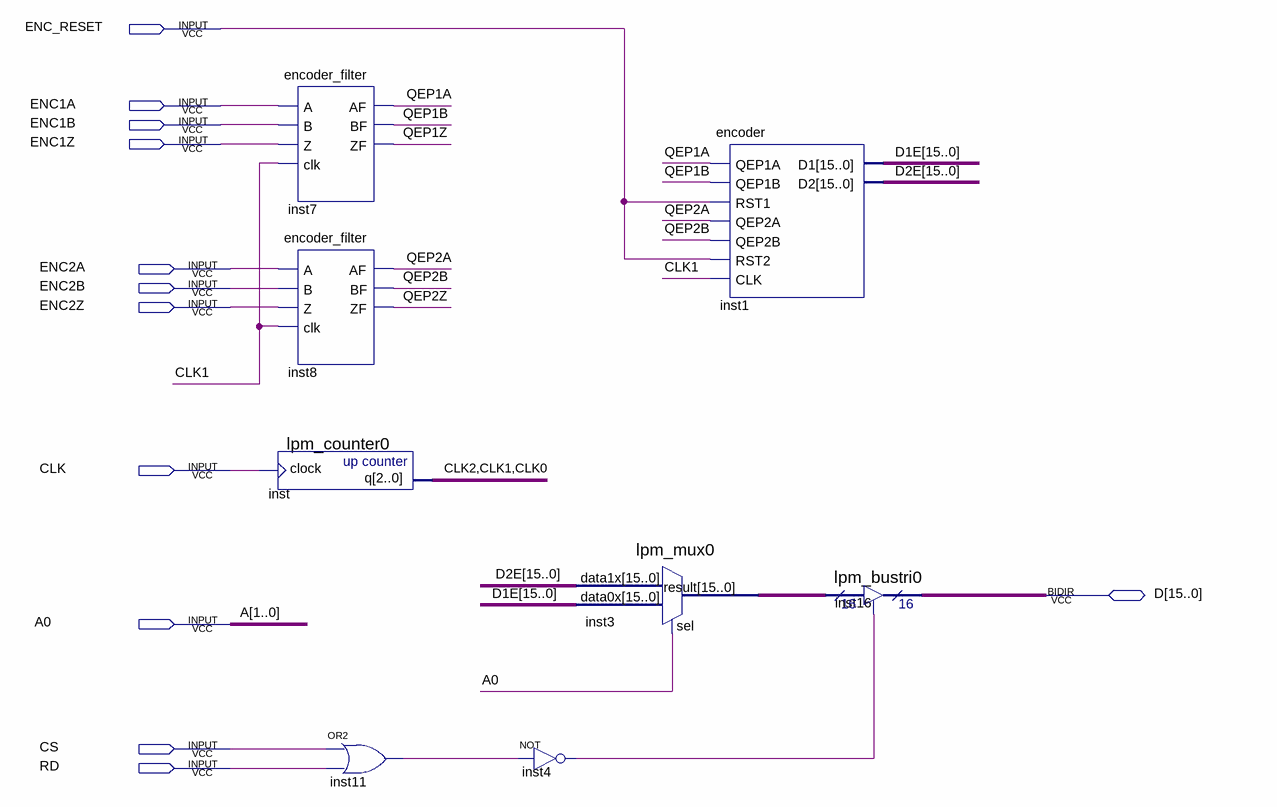
[diagram p0: schematic sheet]
// Quartus schematic enc_module.bdf as structural Verilog: 8 symbols, 12 pins
module enc_module (
  input  ENC_RESET,
  input  ENC1A,
  input  ENC1B,
  input  ENC1Z,
  input  ENC2A,
  input  ENC2B,
  input  ENC2Z,
  input  CLK,
  input  A0,
  input  CS,
  input  RD,
  inout  [15:0] D
);

  wire CLK0, CLK1, CLK2, inst4_out, inst11_out, QEP1A, QEP1B, QEP1Z, QEP2A, QEP2B, QEP2Z;
  wire [15:0] D1E, D2E, inst3_result;

  encoder_filter inst7 (.A(ENC1A), .B(ENC1B), .Z(ENC1Z), .clk(CLK1), .AF(QEP1A), .BF(QEP1B), .ZF(QEP1Z));
  encoder_filter inst8 (.A(ENC2A), .B(ENC2B), .Z(ENC2Z), .clk(CLK1), .AF(QEP2A), .BF(QEP2B), .ZF(QEP2Z));
  lpm_counter0 inst (.clock(CLK), .q({CLK2, CLK1, CLK0}));
  or inst11 (inst11_out, CS, RD);
  not inst4 (inst4_out, inst11_out);
  lpm_mux0 inst3 (.data1x(D2E), .data0x(D1E), .sel(A0), .result(inst3_result));
  encoder inst1 (
    .QEP1A(QEP1A), .QEP1B(QEP1B), .RST1(ENC_RESET), .QEP2A(QEP2A), .QEP2B(QEP2B), .RST2(ENC_RESET),
    .CLK(CLK1), .D1(D1E), .D2(D2E));
  lpm_bustri0 inst16 (.enabledt(inst4_out), .data(inst3_result), .tridata(D));
endmodule
